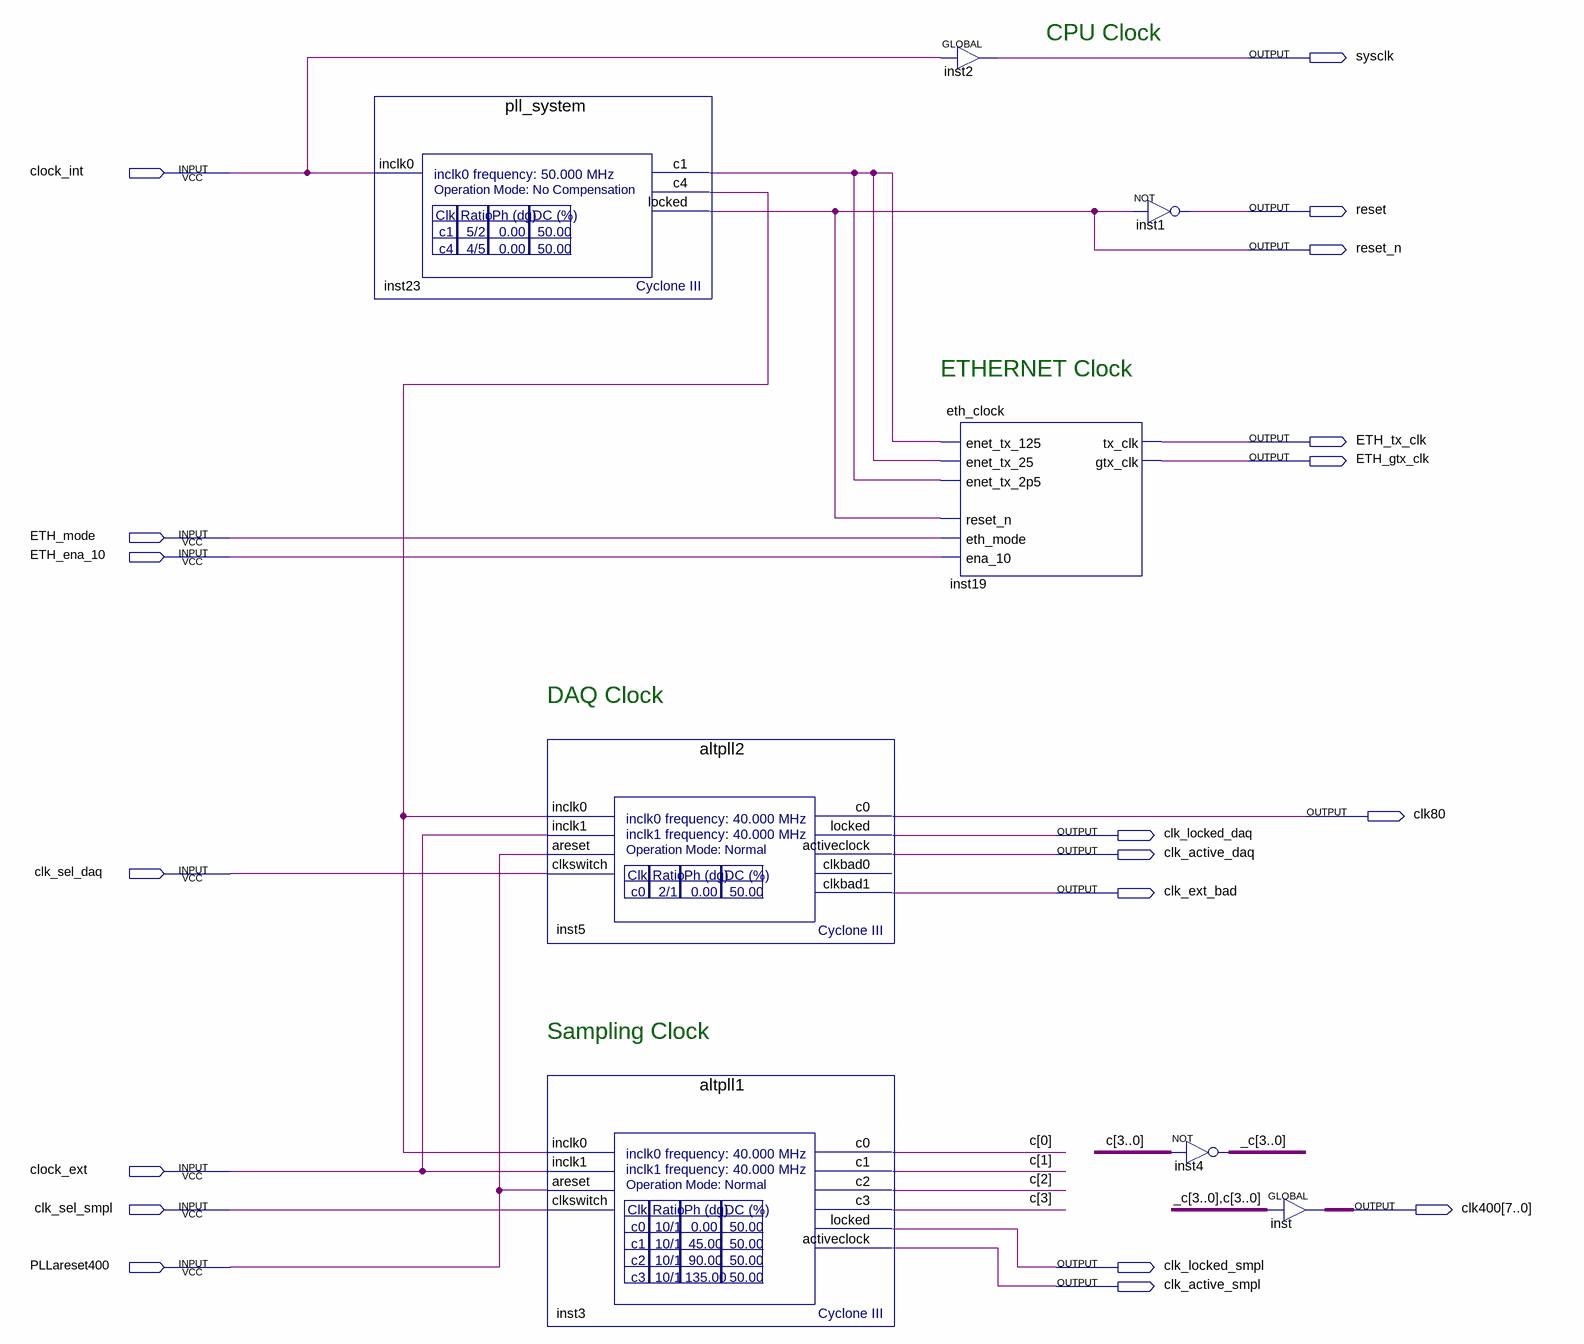
[diagram p0: schematic sheet]
// Quartus schematic clocks.bdf as structural Verilog: 8 symbols, 19 pins
module clocks (
  input  clock_int,
  input  ETH_mode,
  input  ETH_ena_10,
  input  clk_sel_daq,
  input  clock_ext,
  input  clk_sel_smpl,
  input  PLLareset400,
  output sysclk,
  output reset,
  output reset_n,
  output ETH_tx_clk,
  output ETH_gtx_clk,
  output clk80,
  output clk_locked_daq,
  output clk_active_daq,
  output clk_ext_bad,
  output [7:0] clk400,
  output clk_locked_smpl,
  output clk_active_smpl
);

  wire inst23_c1, inst23_c4;
  wire [3:0] _c, c;

  pll_system inst23 (.inclk0(clock_int), .c1(inst23_c1), .c4(inst23_c4), .locked(reset_n));
  altpll2 inst5 (
    .inclk0(inst23_c4), .inclk1(clock_ext), .areset(PLLareset400), .clkswitch(clk_sel_daq), .c0(clk80),
    .locked(clk_locked_daq), .activeclock(clk_active_daq), .clkbad1(clk_ext_bad));  // open: clkbad0
  altpll1 inst3 (
    .inclk0(inst23_c4), .inclk1(clock_ext), .areset(PLLareset400), .clkswitch(clk_sel_smpl), .c0(c[0]),
    .c1(c[1]), .c2(c[2]), .c3(c[3]), .locked(clk_locked_smpl), .activeclock(clk_active_smpl));
  GLOBAL inst2 (.IN(clock_int), .OUT(sysclk));
  eth_clock inst19 (
    .enet_tx_125(inst23_c1), .enet_tx_25(inst23_c1), .enet_tx_2p5(inst23_c1), .reset_n(reset_n),
    .eth_mode(ETH_mode), .ena_10(ETH_ena_10), .tx_clk(ETH_tx_clk), .gtx_clk(ETH_gtx_clk));
  not inst1 (reset, reset_n);
  assign _c = ~c;  // NOT inst4, 4 bits wide
  GLOBAL inst[7:0] (.IN({_c, c}), .OUT(clk400));

  // Notes on the sheet:
  //   CPU Clock
  //   ETHERNET Clock
  //   DAQ Clock
  //   Sampling Clock
endmodule
